# Altium schematic sheet PWR.SchDoc (part 2 of 3)
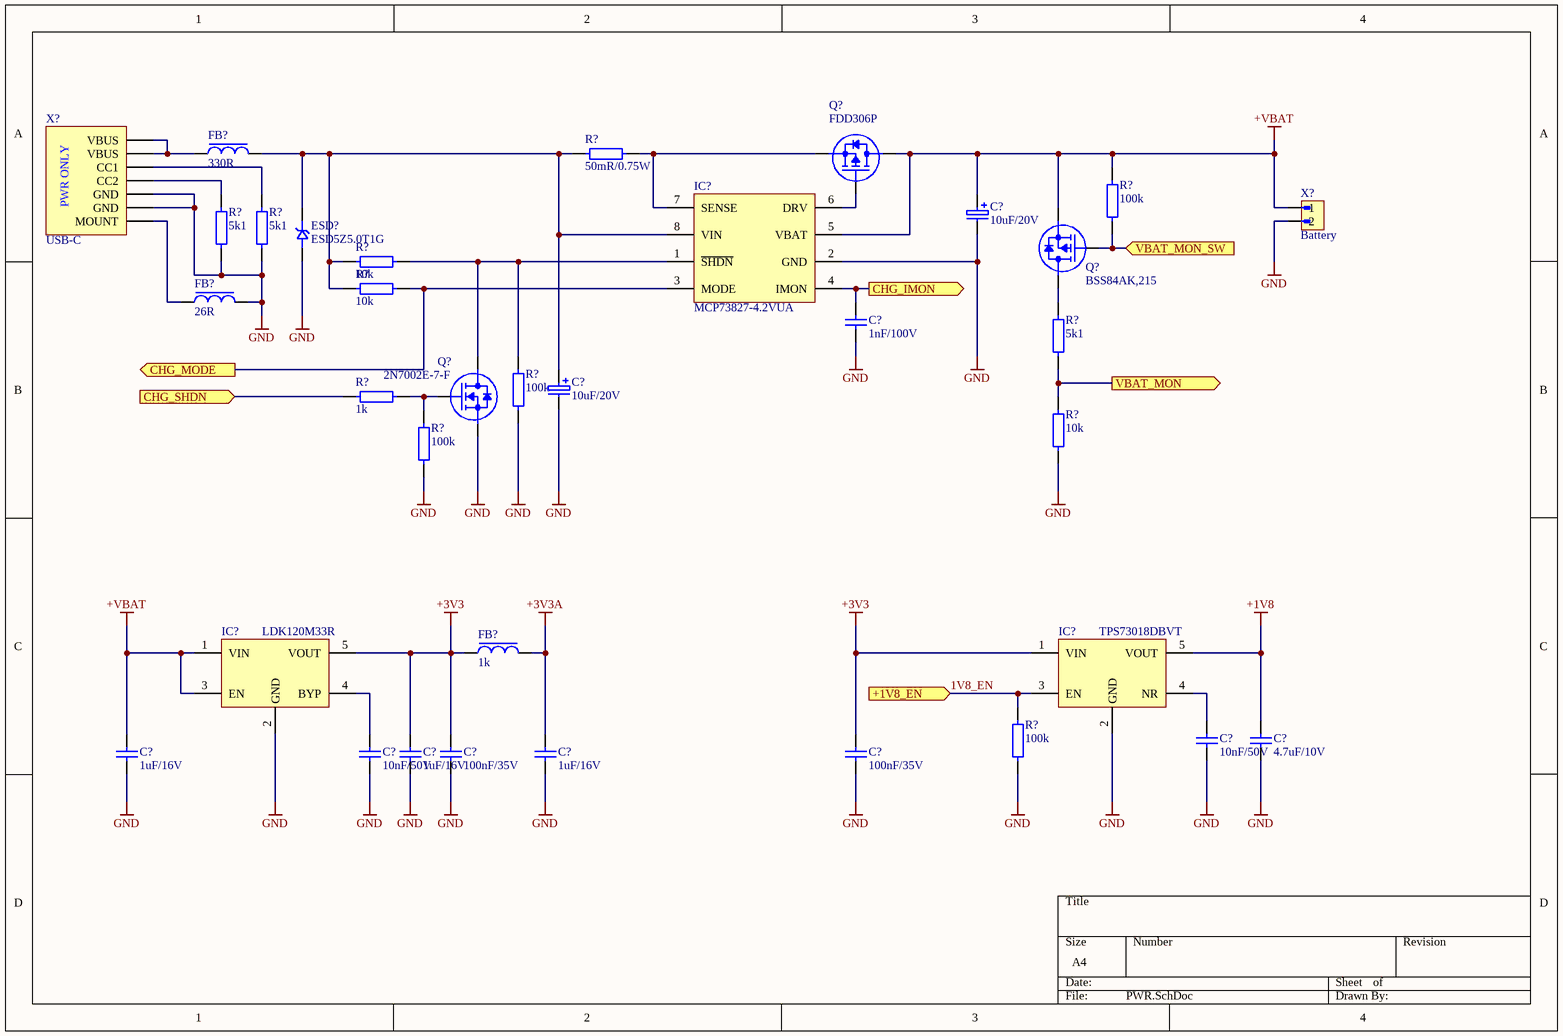
[diagram p1: PWR.SchDoc]
## Library data of the parts
C?#1 C?#3 = TCJB106M020R0150E: Tantalum Capacitors - Polymer 20V 10uF 20%1210 ESR=150ohm Blk Resin; Manufacturer: Kyocera AVX; Manufacturer Part Number: TCJB106M020R0150E; RoHS: Yes; Stock 1: 1215; Pricing 1: 1=0,90000, 10=0,68600, 50=0,56960, 100=0,49050, 500=0,37976, 1000=0,32702 (USD); Supplier 1: DigiKey; Supplier 2: Digi-Key; Supplier 3: Digi-Key; Supplier 4: Mouser; Supplier Part Number 1: 478-TCJB106M020R0150ECT-ND; Supplier Part Number 2: 478-TCJB106M020R0150ECT-ND; Supplier Part Number 3: 478-TCJB106M020R0150EDKR-ND; Supplier Part Number 4: 581-TCJB106M020R150E
C?#2 = 06031C102KAT2A: Cap MLCC SMD 0603 100V X7R 1000pF 10% Commercial Ti/Sn Plated 7"T/R; Manufacturer: Kyocera AVX; Dielectric Material: Ceramic; Capacitance: 1nF; Insulation Resistance: 100GR; Dissipation Factor: 2.5%; Supplier 1: Farnell; Supplier Part Number 1: 1833874; Manufacturer Part Number: 06031C102KAT2A; RoHS: Yes; Category: Ceramic Capacitors; Stock 1: 21717; Pricing 1: 10=0,05170, 100=0,04240, 500=0,02740, 1000=0,02080, 2000=0,01750, 4000=0,01420, 20000=0,01240 (GBP); Mount: Surface Mount,PCB; Case/Package: 0603; Number of Pins: 2; Case Code (Imperial): 0603; Case Code (Metric): 1608; Contact Plating: Tin,Matte; Min Operating Temperature: -55°C; Max Operating Temperature: 125°C; Tolerance: 10%; Dielectric: X7R; Packaging: Tape and Reel; Voltage Rating (DC): 100V; Voltage Rating: 100V; Package Quantity: 1; Termination: SMD/SMT; Voltage: 100V; Length: 1.6mm; Width: 0.81mm; Height: 0.9mm; Depth: 0.81mm; Thickness: 0.035inch; Radiation Hardening: No; REACH SVHC: No SVHC; Lead Free: Lead Free; ComponentLink1URL: https://datasheet.ciiva.com/2987/cx7r-2987733.pdf?src-supplier=Avnet; ComponentLink1Description: https://datasheet.ciiva.com/2987/cx7r-2987733.pdf?src-supplier=Avnet; ComponentLink2URL: https://datasheet.ciiva.com/7855/84526-7855189.pdf?src-supplier=Element14; ComponentLink2Description: https://datasheet.ciiva.com/7855/84526-7855189.pdf?src-supplier=Element14; ComponentLink3URL: https://datasheet.ciiva.com/11499/cx7r-11499669.pdf?src-supplier=Avnet; ComponentLink3Description: https://datasheet.ciiva.com/11499/cx7r-11499669.pdf?src-supplier=Avnet; ComponentLink4URL: https://datasheet.ciiva.com/1124/1679506-1124198.pdf?src-supplier=Element14; ComponentLink4Description: https://datasheet.ciiva.com/1124/1679506-1124198.pdf?src-supplier=Element14; ComponentLink5URL: https://datasheet.ciiva.com/16289/cx7r-16289400.pdf?src-supplier=Future+Electronics; ComponentLink5Description: https://datasheet.ciiva.com/16289/cx7r-16289400.pdf?src-supplier=Future+Electronics; ComponentLink6URL: https://datasheet.ciiva.com/5422/cx7r-218113-5422905.pdf?src-supplier=Mouser; ComponentLink6Description: https://datasheet.ciiva.com/5422/cx7r-218113-5422905.pdf?src-supplier=Mouser; ComponentLink7URL: https://datasheet.ciiva.com/7855/1679506-7855033.pdf?src-supplier=Element14; ComponentLink7Description: https://datasheet.ciiva.com/7855/1679506-7855033.pdf?src-supplier=Element14; ComponentLink8URL: https://datasheet.ciiva.com/150/cx7r-150395.pdf?src-supplier=Digi-Key; ComponentLink8Description: https://datasheet.ciiva.com/150/cx7r-150395.pdf?src-supplier=Digi-Key; ComponentLink9URL: https://datasheet.ciiva.com/22693/1679506-22693579.pdf?src-supplier=Element14; ComponentLink9Description: https://datasheet.ciiva.com/22693/1679506-22693579.pdf?src-supplier=Element14; ComponentLink10URL: https://datasheet.ciiva.com/150/cx7r-150396.pdf?src-supplier=Digi-Key; ComponentLink10Description: https://datasheet.ciiva.com/150/cx7r-150396.pdf?src-supplier=Digi-Key; ComponentLink11URL: https://datasheet.ciiva.com/14600/70001075-14600988.pdf?src-supplier=Allied+Electronics; ComponentLink11Description: https://datasheet.ciiva.com/14600/70001075-14600988.pdf?src-supplier=Allied+Electronics; ComponentLink12URL: https://datasheet.ciiva.com/150/cx7r-150397.pdf?src-supplier=Digi-Key; ComponentLink12Description: https://datasheet.ciiva.com/150/cx7r-150397.pdf?src-supplier=Digi-Key; ComponentLink13URL: https://datasheet.ciiva.com/14594/70001075-14594623.pdf?src-supplier=Allied+Electronics; ComponentLink13Description: https://datasheet.ciiva.com/14594/70001075-14594623.pdf?src-supplier=Allied+Electronics; ComponentLink14URL: https://datasheet.ciiva.com/16484/cx7r-16484383.pdf?src-supplier=Avnet+Asia; ComponentLink14Description: https://datasheet.ciiva.com/16484/cx7r-16484383.pdf?src-supplier=Avnet+Asia
C?#4 = CL10A475KP8NNNC: Cap Ceramic 4.7uF 10V X5R 10% Pad SMD 0603 85C T/R; Manufacturer: Samsung; Manufacturer Part Number: CL10A475KP8NNNC; RoHS: Yes; Category: Ceramic Capacitors; Stock 1: 28417; Pricing 1: 10=0,03100, 100=0,02530, 500=0,01720, 1000=0,01310, 2000=0,01120, 4000=0,00920, 20000=0,00700 (GBP); Mount: Surface Mount; Case/Package: 0603; Case Code (Imperial): 0603; Contact Plating: Tin; Case Code (Metric): 1608; Min Operating Temperature: -55°C; Max Operating Temperature: 85°C; Tolerance: 10%; Capacitance: 4.7uF; Dielectric: X5R; Package Quantity: 1; Packaging: Tape and Reel; Voltage Rating: 10V; Length: 1.6mm; Width: 0.031inch; Height: 0.8mm; Thickness: 0.035inch; Depth: 0.8mm; Radiation Hardening: No; ComponentLink1URL: https://datasheet.ciiva.com/25797/cl10a475kp8nnnc-25797520.pdf?src-supplier=Digi-Key; ComponentLink1Description: https://datasheet.ciiva.com/25797/cl10a475kp8nnnc-25797520.pdf?src-supplier=Digi-Key; ComponentLink2URL: https://datasheet.ciiva.com/26838/getdatasheetpartid-358676-26838384.pdf?src-supplier=Verical; ComponentLink2Description: https://datasheet.ciiva.com/26838/getdatasheetpartid-358676-26838384.pdf?src-supplier=Verical; ComponentLink3URL: https://datasheet.ciiva.com/16318/cl05b104kq5nnnc-16318245.pdf?src-supplier=Future+Electronics; ComponentLink3Description: https://datasheet.ciiva.com/16318/cl05b104kq5nnnc-16318245.pdf?src-supplier=Future+Electronics; Supplier 1: Farnell; Supplier 2: Mouser; Supplier 3: LCSC; Supplier 4: TME; Supplier Part Number 1: 3013398; Supplier Part Number 2: 187-CL10A475KP8NNNC; Supplier Part Number 3: C1705; Supplier Part Number 4: CL10A475KP8NNNC
C?#5 C?#7 = MCU0603R103KCT: MULTICOMP - MCU0603R103KCT - SMD Multilayer Ceramic Capacitor, 10000 pF, 50 V, 0603 [1608 Metric], ± 10%, X7R, MCU Series - SMD Multilayer Ceramic Capacitor, 10000 pF, 50 V, 0603 [1608 Metric], ± 10%, X7R, MCU Series; Voltage Rating: 50V; Capacitance: 10nF; Supplier 1: Farnell; Supplier Part Number 1: 9406182; Manufacturer: Multicomp; Manufacturer Part Number: MCU0603R103KCT; RoHS: Yes; Category: Uncategorized; Stock 1: 18740; Pricing 1: 10=0,01640, 100=0,01320, 500=0,00990, 1000=0,00830, 2000=0,00700, 4000=0,00500, 20000=0,00300, 40000=0,00250 (GBP); Case/Package: 0603; Case Code (Metric): 1608; Case Code (Imperial): 0603; Min Operating Temperature: -55°C; Max Operating Temperature: 125°C; Tolerance: 10%; Packaging: Cut Tape; Voltage Rating (DC): 50V; Dielectric: X7R; REACH SVHC: No SVHC; ComponentLink1URL: https://datasheet.ciiva.com/36857/1859359-36857356.pdf?src-supplier=Element14; ComponentLink1Description: https://datasheet.ciiva.com/36857/1859359-36857356.pdf?src-supplier=Element14; ComponentLink2URL: https://datasheet.ciiva.com/36857/1859359-36857567.pdf?src-supplier=Element14; ComponentLink2Description: https://datasheet.ciiva.com/36857/1859359-36857567.pdf?src-supplier=Element14
C?#6 C?#8 C?#10 = CL10A105KO8NNNC: SAMSUNG ELECTRO-MECHANICS - CL10A105KO8NNNC - CAP, 1UF, 16V, MLCC, 0603; Material: Ceramic; Tolerance: 10%; Dielectric: X5R; Supplier 1: Farnell; Supplier Part Number 1: 3013384; Manufacturer: Samsung; Manufacturer Part Number: CL10A105KO8NNNC; RoHS: Yes; Category: Ceramic Capacitors; Stock 1: 9460; Pricing 1: 10=0,02280, 100=0,01860, 500=0,01290, 1000=0,00990, 2000=0,00880, 4000=0,00770, 20000=0,00540 (GBP); Mount: Surface Mount; Case/Package: 0603; Case Code (Metric): 1608; Case Code (Imperial): 0603; Contact Plating: Tin; Min Operating Temperature: -55°C; Max Operating Temperature: 85°C; Capacitance: 1uF; Package Quantity: 1; Packaging: Tape and Reel; Voltage Rating: 16V; Voltage Rating (DC): 16V; Voltage: 16V; Length: 1.6mm; Width: 0.031inch; Height: 0.8mm; Thickness: 0.035inch; Depth: 0.8mm; Radiation Hardening: No; Lead Free: Lead Free; ComponentLink1URL: https://datasheet.ciiva.com/16199/cl10a105ko8nnnc-16199033.pdf?src-supplier=Future+Electronics; ComponentLink1Description: https://datasheet.ciiva.com/16199/cl10a105ko8nnnc-16199033.pdf?src-supplier=Future+Electronics; ComponentLink2URL: https://datasheet.ciiva.com/15195/getdatasheetpartid-359688-15195706.pdf?src-supplier=Verical; ComponentLink2Description: https://datasheet.ciiva.com/15195/getdatasheetpartid-359688-15195706.pdf?src-supplier=Verical; ComponentLink3URL: https://datasheet.ciiva.com/29198/458190-da-01-en-vs-kondensator-0603-29198480.pdf?src-supplier=Conrad; ComponentLink3Description: https://datasheet.ciiva.com/29198/458190-da-01-en-vs-kondensator-0603-29198480.pdf?src-supplier=Conrad; Supplier 2: Mouser; Supplier Part Number 2: 187-CL10A105KO8NNNC; Stock 2: 346877; Supplier 3: Digi-Key; Supplier Part Number 3: 1276-1034-6-ND; Stock 3: 1912529; Pricing 3: 1=0,10000, 10=0,03500, 50=0,01920, 100=0,01570, 500=0,01124, 1000=0,00883 (USD)
C?#9 C?#11 = 06035G104ZAT2A: CERAMIC CAPACITOR, 0.1UF, 50V, Y5V, +80,-20%, 0603, FULL REEL; Product Range:-; Capacitance:0.1 F; Capacitance Tolerance:+80%, -20%; Dielectric Characteristic:Y5V; Voltage Rating:50V; Ceramic Capacitor Case:0603 [1608 Metric] ;RoHS Compliant: Yes; Manufacturer: Kyocera AVX; Capacitance: 100nF; Tolerance: 80%; Supplier 1: Farnell; Supplier Part Number 1: 2332660; Manufacturer Part Number: 06035G104ZAT2A; RoHS: Yes; Category: Ceramic Capacitors; Stock 1: 29140; Pricing 1: 10=0,03250, 100=0,02120, 500=0,01780, 1000=0,01420, 2000=0,01220 (GBP); Mount: Surface Mount,PCB; Case/Package: 0603; Number of Pins: 2; Case Code (Metric): 1608; Case Code (Imperial): 0603; Contact Plating: Tin,Matte; Dielectric Material: Ceramic; Min Operating Temperature: -30°C; Max Operating Temperature: 85°C; Dielectric: Y5V; Packaging: Tape and Reel; Voltage Rating (DC): 50V; Voltage Rating: 50V; Package Quantity: 1; Termination: SMD/SMT; Voltage: 50V; Series: -; Construction: Flat; Length: 1.6mm; Width: 0.032inch; Height: 0.63mm; Depth: 0.81mm; Thickness: 0.035inch; Radiation Hardening: No; REACH SVHC: No SVHC; Lead Free: Lead Free; RoHS Compliant: Yes; ComponentLink1URL: https://datasheet.ciiva.com/2987/cy5v-2987860.pdf?src-supplier=Avnet; ComponentLink1Description: https://datasheet.ciiva.com/2987/cy5v-2987860.pdf?src-supplier=Avnet; ComponentLink2URL: https://datasheet.ciiva.com/16359/cy5v-16359895.pdf?src-supplier=Future+Electronics; ComponentLink2Description: https://datasheet.ciiva.com/16359/cy5v-16359895.pdf?src-supplier=Future+Electronics; ComponentLink3URL: https://datasheet.ciiva.com/28613/578190-28613048.pdf?src-supplier=Element14; ComponentLink3Description: https://datasheet.ciiva.com/28613/578190-28613048.pdf?src-supplier=Element14; ComponentLink4URL: https://datasheet.ciiva.com/151/cy5v-151545.pdf?src-supplier=Digi-Key; ComponentLink4Description: https://datasheet.ciiva.com/151/cy5v-151545.pdf?src-supplier=Digi-Key; ComponentLink5URL: https://datasheet.ciiva.com/151/cy5v-151546.pdf?src-supplier=Digi-Key; ComponentLink5Description: https://datasheet.ciiva.com/151/cy5v-151546.pdf?src-supplier=Digi-Key; ComponentLink6URL: https://datasheet.ciiva.com/151/cy5v-151547.pdf?src-supplier=Digi-Key; ComponentLink6Description: https://datasheet.ciiva.com/151/cy5v-151547.pdf?src-supplier=Digi-Key; ComponentLink7URL: https://datasheet.ciiva.com/11499/cy5v-11499710.pdf?src-supplier=Avnet; ComponentLink7Description: https://datasheet.ciiva.com/11499/cy5v-11499710.pdf?src-supplier=Avnet; Supplier 2: Mouser; Supplier Part Number 2: 581-06035G104Z; Stock 2: 97036; Pricing 2: 1=0,09000, 10=0,03300, 50=0,03300, 100=0,02700, 1000=0,01600, 10000=0,01000 (USD); Supplier 3: Digi-Key; Supplier Part Number 3: 478-3724-6-ND; Stock 3: 629269; Pricing 3: 1=0,10000, 10=0,05900, 50=0,03220, 100=0,02640, 500=0,01882, 1000=0,01479 (USD)
ESD? = ESD5Z5.0T1G: ESD Suppressors / TVS Diodes 5V ESD Protection Unidirectional, SOD-523; Manufacturer: ON Semiconductor; Clamping Voltage: 18.6V; Peak Pulse Power: 174W; Min Breakdown Voltage: 6.2V; Peak Pulse Current: 9.4A; Element Configuration: Single; Number of Channels: 1; Power Line Protection: No; Capacitance: 80pF; Leakage Current: 50nA; Test Current: 1mA; Diode Type: ZENER; ESD Protection: Yes; Max Power Dissipation: 240W; Clamping Voltage-Max: 11.6V; Supplier 1: Farnell; Manufacturer Part Number: ESD5Z5.0T1G; RoHS: Yes; Category: ESD and Circuit Protection ICs; Pricing 1: 5=0,28400, 10=0,22500, 100=0,11300, 500=0,07020 (GBP); Case/Package: SOD-523-2; Number of Pins: 2; Contact Plating: Tin,Matte; Min Operating Temperature: -55°C; Max Operating Temperature: 150°C; Packaging: Tape and Reel; Direction: Unidirectional; Reverse Standoff Voltage: 5V; Operating Supply Voltage: 5V; Package Quantity: 1; Max Surge Current: 9.4A; Number of Unidirectional Channels: 1; Breakdown Voltage: 6.2V; Polarity: Unidirectional; Termination: SMD/SMT; Working Voltage: 5V; Resistor Type: Zener; Series: Automotive, AEC-Q101; Max Reverse Leakage Current: 50nA; Number of Elements: 1; Reverse Breakdown Voltage: 6.2V; Max Breakdown Voltage: 6.2V; Number of Lines: 1; Length: 1.2mm; Width: 0.9mm; Height: 0.7mm; Depth: 0.8mm; Radiation Hardening: No; RoHS Compliant: Yes; Lead Free: Lead Free; Halogen Free: Halogen Free; REACH SVHC: No SVHC; ComponentLink1URL: https://datasheet.ciiva.com/22637/esd5z2-5t1-d-22637184.pdf?src-supplier=Element14; ComponentLink1Description: https://datasheet.ciiva.com/22637/esd5z2-5t1-d-22637184.pdf?src-supplier=Element14; ComponentLink2URL: https://datasheet.ciiva.com/30479/0900766b8125092b-30479039.pdf?src-supplier=RSComponents; ComponentLink2Description: https://datasheet.ciiva.com/30479/0900766b8125092b-30479039.pdf?src-supplier=RSComponents; ComponentLink3URL: https://datasheet.ciiva.com/15143/getdatasheetpartid-147990-15143766.pdf?src-supplier=Verical; ComponentLink3Description: https://datasheet.ciiva.com/15143/getdatasheetpartid-147990-15143766.pdf?src-supplier=Verical; ComponentLink4URL: https://datasheet.ciiva.com/27748/1311839-27748800.pdf?src-supplier=Jameco; ComponentLink4Description: https://datasheet.ciiva.com/27748/1311839-27748800.pdf?src-supplier=Jameco; ComponentLink5URL: https://datasheet.ciiva.com/8084/esd5z2-5t1-d-8084057.pdf?src-supplier=Avnet; ComponentLink5Description: https://datasheet.ciiva.com/8084/esd5z2-5t1-d-8084057.pdf?src-supplier=Avnet; ComponentLink6URL: https://datasheet.ciiva.com/16385/esd5z2-5t1-d-16385093.pdf?src-supplier=Future+Electronics; ComponentLink6Description: https://datasheet.ciiva.com/16385/esd5z2-5t1-d-16385093.pdf?src-supplier=Future+Electronics; ComponentLink7URL: https://datasheet.ciiva.com/25958/esd5z2-5t1-d-25958603.pdf?src-supplier=Avnet+Europe; ComponentLink7Description: https://datasheet.ciiva.com/25958/esd5z2-5t1-d-25958603.pdf?src-supplier=Avnet+Europe; ComponentLink8URL: https://datasheet.ciiva.com/339/esd5z2-5t1-d-339749.pdf?src-supplier=Digi-Key; ComponentLink8Description: https://datasheet.ciiva.com/339/esd5z2-5t1-d-339749.pdf?src-supplier=Digi-Key; ComponentLink9URL: https://datasheet.ciiva.com/339/esd5z2-5t1-d-339750.pdf?src-supplier=Digi-Key; ComponentLink9Description: https://datasheet.ciiva.com/339/esd5z2-5t1-d-339750.pdf?src-supplier=Digi-Key; ComponentLink10URL: https://datasheet.ciiva.com/339/esd5z2-5t1-d-339748.pdf?src-supplier=Digi-Key; ComponentLink10Description: https://datasheet.ciiva.com/339/esd5z2-5t1-d-339748.pdf?src-supplier=Digi-Key; ComponentLink11URL: https://datasheet.ciiva.com/22637/1878252-22637182.pdf?src-supplier=Element14; ComponentLink11Description: https://datasheet.ciiva.com/22637/1878252-22637182.pdf?src-supplier=Element14; Supplier 2: Mouser; Supplier 3: Digi-Key; Supplier 4: TME; Supplier 5: LCSC; Supplier Part Number 1: 2317510; Supplier Part Number 2: 863-ESD5Z5.0T1G; Supplier Part Number 3: ESD5Z5.0T1GOSCT-ND; Supplier Part Number 4: ESD5Z5.0T1G; Supplier Part Number 5: C82044
FB?#1 = BLM18KG331SN1D: Ferrite Beads 0603 330ohms 1.7A; Manufacturer: Murata; Material: Ferrite,Steel; Tolerance: 25%; Number of Lines: 1; DC Resistance (DCR): 80mR; Test Frequency: 100MHz; Supplier 1: Digi-Key; Manufacturer Part Number: BLM18KG331SN1D; RoHS: Yes; Category: Ferrite Beads and Chips; Stock 1: 59; Pricing 1: 1=0,10000, 10=0,08700, 25=0,07920, 50=0,07120, 100=0,05230, 250=0,03800, 500=0,03484, 1000=0,03010 (USD); Case/Package: 0603; Number of Pins: 2; Core Material: Ferrite; Case Code (Metric): 1608; Case Code (Imperial): 0603; Weight: 7.1E-05oz; Min Operating Temperature: -55°C; Max Operating Temperature: 125°C; Package Quantity: 1; Impedance: 330R; Packaging: Tape and Reel; Current Rating: 1.7A; Max Current Rating: 1.7A; Termination: SMD/SMT; Max DC Current: 1.7A; Number of Circuits: 1; Length: 1.6mm; Width: 0.8mm; Height: 0.8mm; Depth: 0.95mm; REACH SVHC: No SVHC; Lead Free: Lead Free; ComponentLink1URL: https://datasheet.ciiva.com/1012/l0110e-1012338.pdf?src-supplier=Digi-Key; ComponentLink1Description: https://datasheet.ciiva.com/1012/l0110e-1012338.pdf?src-supplier=Digi-Key; ComponentLink2URL: https://datasheet.ciiva.com/1012/l0110e-1012339.pdf?src-supplier=Digi-Key; ComponentLink2Description: https://datasheet.ciiva.com/1012/l0110e-1012339.pdf?src-supplier=Digi-Key; ComponentLink3URL: https://datasheet.ciiva.com/1012/l0110e-1012340.pdf?src-supplier=Digi-Key; ComponentLink3Description: https://datasheet.ciiva.com/1012/l0110e-1012340.pdf?src-supplier=Digi-Key; ComponentLink4URL: https://datasheet.ciiva.com/22715/486545-22715704.pdf?src-supplier=Element14; ComponentLink4Description: https://datasheet.ciiva.com/22715/486545-22715704.pdf?src-supplier=Element14; ComponentLink5URL: https://datasheet.ciiva.com/16419/l0110s0100blm18k-16419178.pdf?src-supplier=Future+Electronics; ComponentLink5Description: https://datasheet.ciiva.com/16419/l0110s0100blm18k-16419178.pdf?src-supplier=Future+Electronics; ComponentLink6URL: https://datasheet.ciiva.com/41449/001171712-da-01-en-chip-drossel0603-330r-xxxma-1-6x0-8mm-41449388.pdf?src-supplier=Conrad; ComponentLink6Description: https://datasheet.ciiva.com/41449/001171712-da-01-en-chip-drossel0603-330r-xxxma-1-6x0-8mm-41449388.pdf?src-supplier=Conrad; Supplier 2: Mouser; Supplier 3: TME; Supplier 4: Farnell; Supplier 5: LCSC; Supplier Part Number 1: 490-5256-1-ND; Supplier Part Number 2: 81-BLM18KG331SN1D; Supplier Part Number 3: BLM18KG331SN1D; Supplier Part Number 4: 1781092; Supplier Part Number 5: C85832
FB?#2 = BLM18KG260TN1D: Ferrite Beads Multi-Layer 26Ohm 25% 100MHz 6A 7mOhm DCR 0603 T/R; Manufacturer: Murata; Material: Ferrite,Steel; DC Resistance (DCR): 7mR; Number of Lines: 1; Supplier 1: Farnell; Manufacturer Part Number: BLM18KG260TN1D; RoHS: Yes; Category: Ferrite Beads and Chips; Stock 1: 251; Pricing 1: 10=0,04380, 100=0,03170, 500=0,01970, 1000=0,01880, 2000=0,01780, 4000=0,01460, 20000=0,01160 (GBP); Case/Package: 0603; Number of Pins: 2; Core Material: Ferrite; Case Code (Metric): 1608; Case Code (Imperial): 0603; Min Operating Temperature: -55°C; Max Operating Temperature: 125°C; Impedance: 26R; Package Quantity: 1; Tolerance: 25%; Packaging: Tape and Reel; Current Rating: 6A; Max Current Rating: 6A; Max DC Current: 6A; Termination: SMD/SMT; Test Frequency: 100MHz; Number of Circuits: 1; Series: BLM18K; DC Resistance-Max: 7mR; Inductor Type: FERRITE BEAD; Length: 1.6mm; Width: 0.8mm; Height: 0.8mm; Depth: 0.95mm; REACH SVHC: No SVHC; Lead Free: Lead Free; RoHS Compliant: Yes; ComponentLink1URL: https://datasheet.ciiva.com/1561/486545-1561360.pdf?src-supplier=Newark; ComponentLink1Description: https://datasheet.ciiva.com/1561/486545-1561360.pdf?src-supplier=Newark; ComponentLink2URL: https://datasheet.ciiva.com/11795/0900766b81076276-11795745.pdf?src-supplier=RSComponents; ComponentLink2Description: https://datasheet.ciiva.com/11795/0900766b81076276-11795745.pdf?src-supplier=RSComponents; ComponentLink3URL: https://datasheet.ciiva.com/3082/l0110s0100blm18k-3082724.pdf?src-supplier=Avnet; ComponentLink3Description: https://datasheet.ciiva.com/3082/l0110s0100blm18k-3082724.pdf?src-supplier=Avnet; ComponentLink4URL: https://datasheet.ciiva.com/1012/l0110e-1012293.pdf?src-supplier=Digi-Key; ComponentLink4Description: https://datasheet.ciiva.com/1012/l0110e-1012293.pdf?src-supplier=Digi-Key; ComponentLink5URL: https://datasheet.ciiva.com/1012/l0110e-1012294.pdf?src-supplier=Digi-Key; ComponentLink5Description: https://datasheet.ciiva.com/1012/l0110e-1012294.pdf?src-supplier=Digi-Key; ComponentLink6URL: https://datasheet.ciiva.com/1012/l0110e-1012295.pdf?src-supplier=Digi-Key; ComponentLink6Description: https://datasheet.ciiva.com/1012/l0110e-1012295.pdf?src-supplier=Digi-Key; ComponentLink7URL: https://datasheet.ciiva.com/22715/486545-22715703.pdf?src-supplier=Element14; ComponentLink7Description: https://datasheet.ciiva.com/22715/486545-22715703.pdf?src-supplier=Element14; ComponentLink8URL: https://datasheet.ciiva.com/16419/l0110s0100blm18k-16419176.pdf?src-supplier=Future+Electronics; ComponentLink8Description: https://datasheet.ciiva.com/16419/l0110s0100blm18k-16419176.pdf?src-supplier=Future+Electronics; Supplier 2: Digi-Key; Supplier 3: Mouser; Supplier 4: TME; Supplier 5: LCSC; Supplier Part Number 1: 1781087; Supplier Part Number 2: 490-5252-1-ND; Supplier Part Number 3: 81-BLM18KG260TN1D; Supplier Part Number 4: BLM18KG260TN1D; Supplier Part Number 5: C88981
FB?#3 = BLM18KG102SZ1D: Ferrite Beads Multi-Layer Power 1KOhm 25% 100MHz 1A 200mOhm DCR 0603 Automotive T/R; Manufacturer: Murata; Number of Lines: 1; DC Resistance (DCR): 200mR; Supplier 1: Digi-Key; Manufacturer Part Number: BLM18KG102SZ1D; RoHS: Yes; Category: Ferrite Beads and Chips; Stock 1: 28125; Pricing 1: 1=0,10000, 10=0,07300, 25=0,06520, 50=0,05540, 100=0,04880, 250=0,04476, 500=0,04070, 1000=0,03419 (USD); Mount: Surface Mount; Case/Package: 0603; Case Code (Imperial): 0603; Case Code (Metric): 1608; Min Operating Temperature: -55°C; Max Operating Temperature: 125°C; Packaging: Cut Tape; Max Current Rating: 1A; Ratings: AEC-Q200; RoHS Compliant: Yes; ComponentLink1URL: https://www.murata.com/~/media/webrenewal/support/library/catalog/products/emc/emifil/c51e.ashx?la=en-us&src-supplier=Digi-Key; ComponentLink1Description: https://www.murata.com/~/media/webrenewal/support/library/catalog/products/emc/emifil/c51e.ashx?la=en-us&src-supplier=Digi-Key; ComponentLink2URL: https://www.murata.com/en-us/products/productdata/8796750610462/QNFA9122.pdf?src-supplier=Digi-Key; ComponentLink2Description: https://www.murata.com/en-us/products/productdata/8796750610462/QNFA9122.pdf?src-supplier=Digi-Key; Supplier 2: Mouser; Supplier 3: Farnell; Supplier Part Number 1: 490-17350-1-ND; Supplier Part Number 2: 81-BLM18KG102SZ1D; Supplier Part Number 3: 3471117
IC?#1 = MCP73827-4.2VUA: MICROCHIP   MCP73827-4.2VUA   BATT CHARGER, LI-ION, 4.2V, 8-MSOP; Min Supply Voltage: 4.5V; Max Supply Voltage: 5.5V; Operating Supply Current: 560mA; Number of Cells: 1; Max Output Current: 75mA; Max Output Voltage: 4.141V; Min Output Voltage: 4.059V; Max Charge Current: 500mA; Battery Type: LITHIUM-ION; Supplier 1: Digi-Key; Manufacturer: Microchip; Manufacturer Part Number: MCP73827-4.2VUA; RoHS: Yes; Category: Battery Management; Stock 1: 51; Pricing 1: 1=1,13000, 25=1,03520 (USD); Mount: Surface Mount; Case/Package: MSOP; Number of Pins: 8; Min Operating Temperature: -20°C; Max Operating Temperature: 85°C; Output Voltage: 4.2V; Packaging: Rail/Tube; Package Quantity: 100; Series: -; Nominal Supply Current: 560mA; Length: 3mm; Width: 4.9mm; Height: 1.1mm; Radiation Hardening: No; Lead Free: Lead Free; RoHS Compliant: Yes; REACH SVHC: No SVHC; ComponentLink1URL: https://datasheet.ciiva.com/1137/809262-1137801.pdf?src-supplier=Element14; ComponentLink1Description: https://datasheet.ciiva.com/1137/809262-1137801.pdf?src-supplier=Element14; ComponentLink2URL: https://datasheet.ciiva.com/1933/filehandler-aspxddocname-en026002-1933092.pdf?src-supplier=Digi-Key; ComponentLink2Description: https://datasheet.ciiva.com/1933/filehandler-aspxddocname-en026002-1933092.pdf?src-supplier=Digi-Key; ComponentLink3URL: https://datasheet.ciiva.com/3215/21704b-3215285.pdf?src-supplier=Avnet; ComponentLink3Description: https://datasheet.ciiva.com/3215/21704b-3215285.pdf?src-supplier=Avnet; ComponentLink4URL: https://datasheet.ciiva.com/4873/21704a-74947-4873749.pdf?src-supplier=Mouser; ComponentLink4Description: https://datasheet.ciiva.com/4873/21704a-74947-4873749.pdf?src-supplier=Mouser; ComponentLink5URL: https://datasheet.ciiva.com/48910/70389230-48910519.pdf?src-supplier=Allied+Electronics; ComponentLink5Description: https://datasheet.ciiva.com/48910/70389230-48910519.pdf?src-supplier=Allied+Electronics; Supplier 2: Mouser; Supplier 3: Farnell; Supplier Part Number 1: MCP73827-4.2VUA-ND; Supplier Part Number 2: 579-MCP73827-4.2VUA; Supplier Part Number 3: 1852161
IC?#2 = LDK120M33R: IC REG LINEAR 3.3V 200MA SOT23-5; Manufacturer: STMicroelectronics; Dropout Voltage: 300mV; Max Input Voltage: 5.5V; Min Input Voltage: 1.9V; Number of Outputs: 1; Nominal Supply Current: 50uA; Polarity: Positive; Quiescent Current: 60uA; Output Voltage Accuracy: 2%; Output Type: Fixed; Supplier 1: Digi-Key; Manufacturer Part Number: LDK120M33R; RoHS: Yes; Category: Voltage Regulators - Linear; Stock 1: 10003; Pricing 1: 1=0,75000, 10=0,66100, 25=0,62120, 100=0,50690, 250=0,47080, 500=0,40068, 1000=0,33075 (USD); Mount: Surface Mount; Case/Package: SOT-23-5; Number of Pins: 5; Min Operating Temperature: -40°C; Max Operating Temperature: 125°C; Max Output Current: 200mA; Package Quantity: 1; Packaging: Tape and Reel; Output Voltage: 3.3V; Output Current: 200mA; Number of Regulators: 1; Accuracy: 2%; Tolerance: 2%; Series: -; Supply Current: 50uA; Lead Free: Lead Free; RoHS Compliant: Yes; ComponentLink1URL: https://datasheet.ciiva.com/41440/001184882-da-01-en-ic-reg-ldo-3-3v-ldk120m33r-sot-23-5-stm-41440022.pdf?src-supplier=Conrad; ComponentLink1Description: https://datasheet.ciiva.com/41440/001184882-da-01-en-ic-reg-ldo-3-3v-ldk120m33r-sot-23-5-stm-41440022.pdf?src-supplier=Conrad; ComponentLink2URL: https://datasheet.ciiva.com/6591/dm00070790-6591189.pdf?src-supplier=Digi-Key; ComponentLink2Description: https://datasheet.ciiva.com/6591/dm00070790-6591189.pdf?src-supplier=Digi-Key; ComponentLink3URL: https://datasheet.ciiva.com/6591/dm00070790-6591190.pdf?src-supplier=Digi-Key; ComponentLink3Description: https://datasheet.ciiva.com/6591/dm00070790-6591190.pdf?src-supplier=Digi-Key; ComponentLink4URL: https://datasheet.ciiva.com/8228/dm00070790-8228653.pdf?src-supplier=Avnet; ComponentLink4Description: https://datasheet.ciiva.com/8228/dm00070790-8228653.pdf?src-supplier=Avnet; Supplier 2: Mouser; Supplier 3: TME; Supplier 4: LCSC; Supplier 5: Farnell; Supplier Part Number 1: 497-13500-1-ND; Supplier Part Number 2: 511-LDK120M33R; Supplier Part Number 3: LDK120M33R; Supplier Part Number 4: C2688675; Supplier Part Number 5: 2849787
IC?#3 = TPS73018DBVT: Fixed LDO Voltage Regulator, 2.7V to 5.5V, 120mV Dropout, 1.8Vout, 200mAout, SOT-23-5; Manufacturer: Texas Instruments; Output Voltage: 1.8V; Number of Outputs: 1; Output Current: 200mA; Max Power Dissipation: 560mW; Min Current Limit: 285mA; Polarity: Positive; Quiescent Current: 170uA; Accuracy: 2%; Supplier 1: Digi-Key; Manufacturer Part Number: TPS73018DBVT; RoHS: Yes; Category: Voltage Regulators - Linear; Stock 1: 5519; Pricing 1: 1=0,93000, 10=0,81900, 25=0,76880, 100=0,62750 (USD); Case/Package: SOT-23; Number of Pins: 5; Contact Plating: Tin,Matte; Min Operating Temperature: -40°C; Max Operating Temperature: 85°C; Packaging: Tape and Reel; Package Quantity: 1; Max Output Current: 200mA; Max Input Voltage: 5.5V; Min Input Voltage: 2.7V; Number of Regulators: 1; Output Type: Fixed; Power Rating: 560mW; Dropout Voltage: 120mV; Input Bias Current: 170uA; Power Dissipation: 560mW; Min Output Voltage: 1.8V; Output Voltage Accuracy: 2%; Max Output Voltage: 1.8V; Nominal Output Voltage: 1.8V; Min Supply Voltage: 2.7V; Termination: SMD/SMT; Length: 2.9mm; Width: 1.6mm; Height: 1.15mm; Radiation Hardening: No; Lead Free: Lead Free; RoHS Compliant: Yes; REACH SVHC: No SVHC; ComponentLink1URL: https://datasheet.ciiva.com/26904/tps73018dbvt-26904036.pdf?src-supplier=IIIC; ComponentLink1Description: https://datasheet.ciiva.com/26904/tps73018dbvt-26904036.pdf?src-supplier=IIIC; ComponentLink2URL: https://datasheet.ciiva.com/41462/001014994-da-01-en-ic-reg-ldo-1-8v-0-tps73018dbvt-sot-5-tid-41462839.pdf?src-supplier=Conrad; ComponentLink2Description: https://datasheet.ciiva.com/41462/001014994-da-01-en-ic-reg-ldo-1-8v-0-tps73018dbvt-sot-5-tid-41462839.pdf?src-supplier=Conrad; ComponentLink3URL: https://datasheet.ciiva.com/46390/1877105-46390197.pdf?src-supplier=Element14; ComponentLink3Description: https://datasheet.ciiva.com/46390/1877105-46390197.pdf?src-supplier=Element14; ComponentLink4URL: https://datasheet.ciiva.com/2052/tps730-2052232.pdf?src-supplier=Digi-Key; ComponentLink4Description: https://datasheet.ciiva.com/2052/tps730-2052232.pdf?src-supplier=Digi-Key; ComponentLink5URL: https://datasheet.ciiva.com/28684/1877105-28684534.pdf?src-supplier=Element14; ComponentLink5Description: https://datasheet.ciiva.com/28684/1877105-28684534.pdf?src-supplier=Element14; ComponentLink6URL: https://datasheet.ciiva.com/7993/1861024-7993016.pdf?src-supplier=Element14; ComponentLink6Description: https://datasheet.ciiva.com/7993/1861024-7993016.pdf?src-supplier=Element14; ComponentLink7URL: https://datasheet.ciiva.com/22700/1861024-22700040.pdf?src-supplier=Element14; ComponentLink7Description: https://datasheet.ciiva.com/22700/1861024-22700040.pdf?src-supplier=Element14; ComponentLink8URL: https://datasheet.ciiva.com/2052/tps730-2052233.pdf?src-supplier=Digi-Key; ComponentLink8Description: https://datasheet.ciiva.com/2052/tps730-2052233.pdf?src-supplier=Digi-Key; ComponentLink9URL: https://datasheet.ciiva.com/2052/tps730-2052234.pdf?src-supplier=Digi-Key; ComponentLink9Description: https://datasheet.ciiva.com/2052/tps730-2052234.pdf?src-supplier=Digi-Key; ComponentLink10URL: https://datasheet.ciiva.com/46385/1877105-46385674.pdf?src-supplier=Element14; ComponentLink10Description: https://datasheet.ciiva.com/46385/1877105-46385674.pdf?src-supplier=Element14; Supplier 2: Mouser; Supplier 3: TME; Supplier 4: Farnell; Supplier Part Number 1: 296-17577-1-ND; Supplier Part Number 2: 595-TPS73018DBVT; Supplier Part Number 3: TPS73018DBVT; Supplier Part Number 4: 3007850
Q?#1 = FDD306P: Trans MOSFET P-CH 12V 6.7A 3-Pin(2+Tab) TO-252AA T/R; Manufacturer: ON Semiconductor / Fairchild; Rise Time: 8ns; Rds On Max: 28mR; Input Capacitance: 1.29nF; Nominal Vgs: -500mV; Max Power Dissipation: 52W; Number of Elements: 1; Fall Time: 41ns; Turn-Off Delay Time: 34ns; Turn-On Delay Time: 16ns; Element Configuration: Single; Drain to Source Breakdown Voltage: -12V; Gate to Source Voltage (Vgs): 8V; Current Rating: -6.7A; On-State Resistance: 90MR; Polarity: P-CHANNEL; Supplier 1: Digi-Key; Manufacturer Part Number: FDD306P; RoHS: Yes; Category: MOSFETs; Stock 1: 163; Pricing 1: 1=0,93000, 10=0,83100, 100=0,64770, 500=0,53504, 1000=0,44800 (USD); Mount: Surface Mount; Case/Package: TO-252AA; Number of Pins: 3; Contact Plating: Tin,Matte; Weight: 0.26037g; Min Operating Temperature: -55°C; Max Operating Temperature: 175°C; Package Quantity: 1; Packaging: Tape and Reel; Drain to Source Voltage (Vdss): 12V; Continuous Drain Current (ID): 6.7A; Power Dissipation: 52W; Drain to Source Resistance: 28mR; Voltage Rating (DC): -12V; Series: PowerTrench®; Drain-source On Resistance-Max: 90MR; Dual Supply Voltage: -12V; Threshold Voltage: -500mV; Length: 6.73mm; Width: 6.22mm; Height: 2.39mm; Radiation Hardening: No; REACH SVHC: No SVHC; Lead Free: Lead Free; RoHS Compliant: Yes; ComponentLink1URL: https://datasheet.ciiva.com/6382/fdd306p-6382784.pdf?src-supplier=Digi-Key; ComponentLink1Description: https://datasheet.ciiva.com/6382/fdd306p-6382784.pdf?src-supplier=Digi-Key; ComponentLink2URL: https://datasheet.ciiva.com/6037/83415-6037185.pdf?src-supplier=Farnell; ComponentLink2Description: https://datasheet.ciiva.com/6037/83415-6037185.pdf?src-supplier=Farnell; ComponentLink3URL: https://datasheet.ciiva.com/4441/fdd306p-46305-4441610.pdf?src-supplier=Mouser; ComponentLink3Description: https://datasheet.ciiva.com/4441/fdd306p-46305-4441610.pdf?src-supplier=Mouser; ComponentLink4URL: https://datasheet.ciiva.com/25625/0900766b810c9606-25625803.pdf?src-supplier=RSComponents; ComponentLink4Description: https://datasheet.ciiva.com/25625/0900766b810c9606-25625803.pdf?src-supplier=RSComponents; ComponentLink5URL: https://datasheet.ciiva.com/6382/fdd306p-6382789.pdf?src-supplier=Digi-Key; ComponentLink5Description: https://datasheet.ciiva.com/6382/fdd306p-6382789.pdf?src-supplier=Digi-Key; ComponentLink6URL: https://datasheet.ciiva.com/26144/fdd306p-26144694.pdf?src-supplier=Avnet+Europe; ComponentLink6Description: https://datasheet.ciiva.com/26144/fdd306p-26144694.pdf?src-supplier=Avnet+Europe; ComponentLink7URL: https://datasheet.ciiva.com/7967/1815137-7967866.pdf?src-supplier=Element14; ComponentLink7Description: https://datasheet.ciiva.com/7967/1815137-7967866.pdf?src-supplier=Element14; ComponentLink8URL: https://datasheet.ciiva.com/17275/fdd306p-17275019.pdf?src-supplier=Future+Electronics; ComponentLink8Description: https://datasheet.ciiva.com/17275/fdd306p-17275019.pdf?src-supplier=Future+Electronics; Supplier 2: Mouser; Supplier 3: Farnell; Supplier 4: TME; Supplier Part Number 1: FDD306PCT-ND; Supplier Part Number 2: 512-FDD306P; Supplier Part Number 3: 9958827; Supplier Part Number 4: FDD306P
Q?#2 = BSS84AK,215: Small Signal Field-Effect Transistor, 0.18A I(D), 50V, 1-Element, P-Channel, Silicon, Metal-oxide Semiconductor FET, TO-236AB; Manufacturer: Nexperia; Package Body Material: Plastic; Drain Current-Max (ID): 180mA; Drain-source On Resistance-Max: 8.5R; Number of Elements: 1; Operating Mode: ENHANCEMENT MODE; Time @ Peak Reflow Temperature-Max (s): 30s; Transistor Application: SWITCHING; Reference Standard: AEC-Q101; Supplier 1: Farnell; Supplier Part Number 1: 1972673; Manufacturer Part Number: BSS84AK,215; RoHS: Yes; Category: MOSFETs; Stock 1: 14518; Pricing 1: 5=0,19500, 10=0,13100, 100=0,05230, 500=0,03910, 1000=0,02580, 5000=0,02360 (GBP); Number of Pins: 3; Package Shape: Rectangular; Terminal Finish: Tin; Transistor Element Material: SILICON; JESD-609 Code: e3; Polarity/Channel Type: P-CHANNEL; DS Breakdown Voltage-Min: 50V; FET Technology: METAL-OXIDE SEMICONDUCTOR; JESD-30 Code: R-PDSO-G3; Moisture Sensitivity Level: 1; Package Style: SMALL OUTLINEMeter; Peak Reflow Temperature (Cel): 260°C; Surface Mount: Yes; Terminal Form: Gull Wing; Terminal Position: DUAL; JEDEC-95 Code: TO-236AB; REACH SVHC: Yes; RoHS Compliant: Yes; ComponentLink1URL: https://datasheet.ciiva.com:443/pdfs/VipMasterIC/IC/NEXP/NEXP-S-A0002881811/NEXP-S-A0002881395-1.pdf?src-supplier=IHS+Markit; ComponentLink1Description: https://datasheet.ciiva.com:443/pdfs/VipMasterIC/IC/NEXP/NEXP-S-A0002881811/NEXP-S-A0002881395-1.pdf?src-supplier=IHS+Markit; ComponentLink2URL: http://www.farnell.com/datasheets/1443354.pdf?src-supplier=Farnell; ComponentLink2Description: http://www.farnell.com/datasheets/1443354.pdf?src-supplier=Farnell; ComponentLink3URL: https://assets.nexperia.com/documents/data-sheet/BSS84AK.pdf?src-supplier=Digi-Key; ComponentLink3Description: https://assets.nexperia.com/documents/data-sheet/BSS84AK.pdf?src-supplier=Digi-Key; Supplier 2: Mouser; Supplier Part Number 2: 771-BSS84AK215; Stock 2: 5227; Pricing 2: 1=0,20000, 10=0,13500, 50=0,13500, 100=0,05600, 1000=0,03900, 10000=0,02700 (USD); Supplier 3: Digi-Key; Supplier Part Number 3: 1727-1144-6-ND; Stock 3: 109157; Pricing 3: 1=0,19000, 10=0,15300, 25=0,12840, 100=0,08120, 500=0,05344, 1000=0,03634 (USD)
Q?#3 = 2N7002E-7-F: MOSFET N-Channel; Manufacturer: Diodes; Continuous Drain Current (ID): 250mA; Rds On Max: 3R; Input Capacitance: 50pF; Drain to Source Voltage (Vdss): 60V; Max Power Dissipation: 370mW; Turn-Off Delay Time: 11ns; Turn-On Delay Time: 7ns; Gate to Source Voltage (Vgs): 20V; Drain to Source Resistance: 4R; Power Dissipation: 540mW; Number of Elements: 1; Element Configuration: Single; Manufacturer Part Number: 2N7002E-7-F; RoHS: Yes; Category: MOSFETs; Stock 1: 1805; Pricing 1: 5=0,03360, 25=0,03050, 100=0,02730, 250=0,02520, 500=0,02210, 1000=0,01680 (GBP); Mount: Surface Mount; Case/Package: SOT-23-3; Number of Pins: 3; Weight: 0.000282oz; Min Operating Temperature: -55°C; Max Operating Temperature: 150°C; Packaging: Tape and Reel; Package Quantity: 1; Drain to Source Breakdown Voltage: 60V; Number of Channels: 1; On-State Resistance: 4R; Polarity: N-CHANNEL; Series: -; Drain-source On Resistance-Max: 4R; Length: 2.9mm; Width: 1.3mm; Height: 1mm; Radiation Hardening: No; Lead Free: Lead Free; REACH SVHC: No SVHC; RoHS Compliant: Yes; ComponentLink1URL: https://datasheet.ciiva.com/4443/ds30376-87503-4443073.pdf?src-supplier=Mouser; ComponentLink1Description: https://datasheet.ciiva.com/4443/ds30376-87503-4443073.pdf?src-supplier=Mouser; ComponentLink2URL: https://datasheet.ciiva.com/16305/ds30376-16305448.pdf?src-supplier=Future+Electronics; ComponentLink2Description: https://datasheet.ciiva.com/16305/ds30376-16305448.pdf?src-supplier=Future+Electronics; ComponentLink3URL: https://datasheet.ciiva.com/11174/ds30376-11174910.pdf?src-supplier=Avnet; ComponentLink3Description: https://datasheet.ciiva.com/11174/ds30376-11174910.pdf?src-supplier=Avnet; ComponentLink4URL: https://datasheet.ciiva.com/6371/ds30376-6371036.pdf?src-supplier=Digi-Key; ComponentLink4Description: https://datasheet.ciiva.com/6371/ds30376-6371036.pdf?src-supplier=Digi-Key; ComponentLink5URL: https://datasheet.ciiva.com/6371/ds30376-6371039.pdf?src-supplier=Digi-Key; ComponentLink5Description: https://datasheet.ciiva.com/6371/ds30376-6371039.pdf?src-supplier=Digi-Key; Stock 2: 8667; Pricing 2: 1=0,27000, 10=0,18100, 50=0,18100, 100=0,08700, 1000=0,05100, 10000=0,03400 (USD); Stock 3: 35005; Pricing 3: 1=0,29000, 10=0,19800, 25=0,18720, 100=0,09680, 500=0,08074, 1000=0,05610 (USD); Stock 4: 10690; Pricing 4: 10=0,06870, 100=0,05240, 300=0,04940, 1000=0,04640, 5000=0,04510, 10000=0,04450, 10=0,06680, 100=0,05100, 300=0,04810, 1000=0,04520, 5000=0,04390, 10000=0,04330, 10=0,34300, 100=0,26180, 300=0,24690, 1000=0,23190, 5000=0,22540, 10000=0,22220, 10=0,32960, 100=0,25160, 300=0,23720, 1000=0,22280, 5000=0,21660, 10000=0,21350, 10=0,04430, 100=0,03380, 300=0,03190, 1000=0,03000, 5000=0,02910, 10000=0,02870, 10=0,03820, 100=0,02910, 300=0,02750, 1000=0,02580, 5000=0,02510, 10000=0,02470, 10=0,40990, 100=0,31290, 300=0,29500, 1000=0,27720, 5000=0,26940, 10000=0,26550, 10=5,72380, 100=4,36870, 300=4,11940, 1000=3,87010, 5000=3,76170, 10000=3,70750, 10=0,21510, 100=0,16420, 300=0,15480, 1000=0,14540, 5000=0,14140, 10000=0,13930, 10=3,92540, 100=2,99610, 300=2,82510, 1000=2,65410, 5000=2,57980, 10000=2,54260, 10=0,45030, 100=0,34370, 300=0,32410, 1000=0,30440, 5000=0,29590, 10000=0,29160, 10=0,07090, 100=0,05410, 300=0,05100, 1000=0,04790, 5000=0,04660, 10000=0,04590, 10=0,05280, 100=0,04030, 300=0,03800, 1000=0,03570, 5000=0,03470, 10000=0,03420 (AUD); Supplier 1: Farnell; Supplier Part Number 1: 3577032; Supplier 2: Mouser; Supplier Part Number 2: 621-2N7002E-7-F; Supplier 3: Digi-Key; Supplier Part Number 3: 2N7002E-FDIDKR-ND; Supplier 4: LCSC; Supplier Part Number 4: C151383; Supplier 5: Mouser; Supplier Part Number 5: 771-NX7002AKAR; Supplier 6: Farnell; Supplier Part Number 6: 3287982
R?#1 = MCWW12W0R05FTL: Res, 0R05, 1%, 0.75W, 1206, Thick Film; Manufacturer: Multicomp; Supplier 1: Farnell; Manufacturer Part Number: MCWW12W0R05FTL; RoHS: No; Stock 1: 4386; Pricing 1: 10=0,18300, 100=0,09790, 500=0,07440, 1000=0,06530 (GBP); ComponentLink1URL: http://www.farnell.com/datasheets/2189763.pdf?src-supplier=Farnell; ComponentLink1Description: http://www.farnell.com/datasheets/2189763.pdf?src-supplier=Farnell; ComponentLink2URL: http://www.farnell.com/datasheets/2189763.pdf?src-supplier=Newark; ComponentLink2Description: http://www.farnell.com/datasheets/2189763.pdf?src-supplier=Newark; Supplier Part Number 1: 2695178
R?#2 R?#9 R?#11 R?#12 = CR0603-FX-1003ELF: Bourns CR0603-FX Series Thick Film Surface Mount Fixed Resistor 0603 Case 100k 1% 0.1W 100ppm/C; Temperature Coefficient: 100ppm/°C; Resistance: 100kR; Voltage Rating (DC): 50V; Max Power Dissipation: 100mW; Manufacturer: Bourns; Manufacturer Part Number: CR0603-FX-1003ELF; RoHS: Yes; Category: Chip SMD Resistors; Stock 1: 282; Pricing 1: 1=0,10000, 10=0,01700, 100=0,00680, 1000=0,00305, 2500=0,00264 (USD); Mount: Surface Mount; Case/Package: 0603; Number of Pins: 2; Contact Plating: Tin; Case Code (Metric): 1608; Case Code (Imperial): 0603; Min Operating Temperature: -55°C; Max Operating Temperature: 155°C; Resistor Type: Thick Film; Tolerance: 1%; Number of Terminations: 2; Termination: SMD/SMT; Features: Moisture Resistant; Packaging: Tape and Reel; Power Rating: 100mW; Voltage Rating: 50V; Package Quantity: 1; Working Voltage: 50V; Length: 1.6mm; Width: 0.031inch; Height: 0.022inch; Depth: 0.8mm; Thickness: 457um; Radiation Hardening: No; REACH SVHC: No SVHC; Military Standard: Not; ComponentLink1URL: https://datasheet.ciiva.com/11808/0900766b80fcdb72-11808036.pdf?src-supplier=RSComponents; ComponentLink1Description: https://datasheet.ciiva.com/11808/0900766b80fcdb72-11808036.pdf?src-supplier=RSComponents; ComponentLink2URL: https://datasheet.ciiva.com/19466/1163741-19466516.pdf?src-supplier=Jameco; ComponentLink2Description: https://datasheet.ciiva.com/19466/1163741-19466516.pdf?src-supplier=Jameco; ComponentLink3URL: https://datasheet.ciiva.com/41449/001055485-da-01-en-smd-wid-cr0603-fx-1003elf-100k-ohm-1-10w-41449971.pdf?src-supplier=Conrad; ComponentLink3Description: https://datasheet.ciiva.com/41449/001055485-da-01-en-smd-wid-cr0603-fx-1003elf-100k-ohm-1-10w-41449971.pdf?src-supplier=Conrad; ComponentLink4URL: https://datasheet.ciiva.com/46385/691949-46385260.pdf?src-supplier=Element14; ComponentLink4Description: https://datasheet.ciiva.com/46385/691949-46385260.pdf?src-supplier=Element14; ComponentLink5URL: https://datasheet.ciiva.com/6547/chpreztr-6547309.pdf?src-supplier=Digi-Key; ComponentLink5Description: https://datasheet.ciiva.com/6547/chpreztr-6547309.pdf?src-supplier=Digi-Key; ComponentLink6URL: https://datasheet.ciiva.com/6547/chpreztr-6547310.pdf?src-supplier=Digi-Key; ComponentLink6Description: https://datasheet.ciiva.com/6547/chpreztr-6547310.pdf?src-supplier=Digi-Key; ComponentLink7URL: https://datasheet.ciiva.com/3255/chpreztr-3255919.pdf?src-supplier=Avnet; ComponentLink7Description: https://datasheet.ciiva.com/3255/chpreztr-3255919.pdf?src-supplier=Avnet; ComponentLink8URL: https://datasheet.ciiva.com/16782/70154685-16782911.pdf?src-supplier=Allied+Electronics; ComponentLink8Description: https://datasheet.ciiva.com/16782/70154685-16782911.pdf?src-supplier=Allied+Electronics; ComponentLink9URL: https://datasheet.ciiva.com/22693/1902866-22693207.pdf?src-supplier=Element14; ComponentLink9Description: https://datasheet.ciiva.com/22693/1902866-22693207.pdf?src-supplier=Element14; ComponentLink10URL: https://datasheet.ciiva.com/16941/chpreztr-16941643.pdf?src-supplier=Avnet+Europe; ComponentLink10Description: https://datasheet.ciiva.com/16941/chpreztr-16941643.pdf?src-supplier=Avnet+Europe; ComponentLink11URL: https://datasheet.ciiva.com/15159/getdatasheetpartid-57636-15159629.pdf?src-supplier=Verical; ComponentLink11Description: https://datasheet.ciiva.com/15159/getdatasheetpartid-57636-15159629.pdf?src-supplier=Verical; ComponentLink12URL: https://datasheet.ciiva.com/5546/chpreztr-5546894.pdf?src-supplier=Mouser; ComponentLink12Description: https://datasheet.ciiva.com/5546/chpreztr-5546894.pdf?src-supplier=Mouser; ComponentLink13URL: https://datasheet.ciiva.com/7986/1902866-7986158.pdf?src-supplier=Element14; ComponentLink13Description: https://datasheet.ciiva.com/7986/1902866-7986158.pdf?src-supplier=Element14; ComponentLink14URL: https://datasheet.ciiva.com/6547/chpreztr-6547311.pdf?src-supplier=Digi-Key; ComponentLink14Description: https://datasheet.ciiva.com/6547/chpreztr-6547311.pdf?src-supplier=Digi-Key; ComponentLink15URL: https://datasheet.ciiva.com/30120/159chpreztr-30120559.pdf?src-supplier=Onlinecomponents.com; ComponentLink15Description: https://datasheet.ciiva.com/30120/159chpreztr-30120559.pdf?src-supplier=Onlinecomponents.com; Supplier 1: Digi-Key; Supplier 2: Mouser; Supplier 3: Farnell; Supplier Part Number 1: CR0603-FX-1003ELFCT-ND; Supplier Part Number 2: 652-CR0603-FX-103ELF; Supplier Part Number 3: 2008342
R?#3 R?#4 R?#7 = CR0603-FX-5101ELF: Res Thick Film 0603 5.1K Ohm 1% 1/10W ±100ppm/C Molded SMD SMD Paper Tape on Plastic Reel; Manufacturer: Bourns; Resistance: 5.1kR; Temperature Coefficient: 100ppm/°C; Power Rating: 100mW; Voltage Rating: 50V; Supplier 1: Digi-Key; Manufacturer Part Number: CR0603-FX-5101ELF; RoHS: Yes; Category: Chip SMD Resistors; Stock 1: 5051; Pricing 1: 1=0,10000, 10=0,01700, 100=0,00680, 1000=0,00305, 2500=0,00264 (USD); Mount: Surface Mount; Case/Package: 0603; Contact Plating: Tin; Case Code (Imperial): 0603; Case Code (Metric): 1608; Min Operating Temperature: -55°C; Max Operating Temperature: 155°C; Tolerance: 1%; Resistor Type: Thick Film; Packaging: Tape and Reel; Package Quantity: 5000; Termination: SMD/SMT; Features: Moisture Resistant; Series: CR0603; Max Power Dissipation: 100mW; Number of Terminations: 2; Construction: Rectangular; Voltage Rating (DC): 50V; Resistance Tolerance: 1%; Length: 1.6mm; Width: 0.8mm; Height: 0.45mm; Thickness: 457um; Depth: 0.8mm; Radiation Hardening: No; RoHS Compliant: Yes; Military Standard: Not; REACH SVHC: No SVHC; ComponentLink1URL: https://datasheet.ciiva.com/16939/chpreztr-16939916.pdf?src-supplier=Avnet+Europe; ComponentLink1Description: https://datasheet.ciiva.com/16939/chpreztr-16939916.pdf?src-supplier=Avnet+Europe; Supplier 2: Mouser; Supplier 3: Farnell; Supplier Part Number 1: CR0603-FX-5101ELFCT-ND; Supplier Part Number 2: 652-CR0603FX-5101ELF; Supplier Part Number 3: 2333596
R?#5 R?#6 R?#10 = CR0603-FX-1002ELF: Thick Film Resistors 10K 1% 1/10W; Manufacturer: Bourns; Resistance: 10kR; Temperature Coefficient: 100ppm/°C; Power Rating: 100mW; Voltage Rating: 50V; Manufacturer Part Number: CR0603-FX-1002ELF; RoHS: Yes; Category: Chip SMD Resistors; Stock 1: 5832; Pricing 1: 1=0,10000, 10=0,01700, 100=0,00680, 1000=0,00305, 2500=0,00264 (USD); Mount: Surface Mount; Case/Package: 0603; Number of Pins: 2; Contact Plating: Tin; Case Code (Metric): 1608; Case Code (Imperial): 0603; Min Operating Temperature: -55°C; Max Operating Temperature: 155°C; Tolerance: 1%; Resistor Type: Thick Film; Packaging: Tape and Reel; Package Quantity: 5000; Number of Terminations: 2; Termination: SMD/SMT; Max Power Dissipation: 100mW; Voltage Rating (DC): 50V; Features: Moisture Resistant; Series: CR0603; Resistance Tolerance: 1%; Technology: THICK FILM; Construction: Rectangular; Length: 1.6mm; Width: 0.8mm; Height: 0.45mm; Depth: 0.8mm; Thickness: 457um; Radiation Hardening: No; REACH SVHC: No SVHC; Military Standard: Not; RoHS Compliant: Yes; ComponentLink1URL: https://datasheet.ciiva.com/11808/0900766b80fcdb72-11808032.pdf?src-supplier=RSComponents; ComponentLink1Description: https://datasheet.ciiva.com/11808/0900766b80fcdb72-11808032.pdf?src-supplier=RSComponents; ComponentLink2URL: https://datasheet.ciiva.com/27049/774903-27049975.pdf?src-supplier=Jameco; ComponentLink2Description: https://datasheet.ciiva.com/27049/774903-27049975.pdf?src-supplier=Jameco; ComponentLink3URL: https://datasheet.ciiva.com/22693/1902866-22693206.pdf?src-supplier=Element14; ComponentLink3Description: https://datasheet.ciiva.com/22693/1902866-22693206.pdf?src-supplier=Element14; ComponentLink4URL: https://datasheet.ciiva.com/7001/1902866-7001623.pdf?src-supplier=Newark; ComponentLink4Description: https://datasheet.ciiva.com/7001/1902866-7001623.pdf?src-supplier=Newark; ComponentLink5URL: https://datasheet.ciiva.com/16757/70154685-16757483.pdf?src-supplier=Allied+Electronics; ComponentLink5Description: https://datasheet.ciiva.com/16757/70154685-16757483.pdf?src-supplier=Allied+Electronics; ComponentLink6URL: https://datasheet.ciiva.com/22644/1849498-22644171.pdf?src-supplier=Element14; ComponentLink6Description: https://datasheet.ciiva.com/22644/1849498-22644171.pdf?src-supplier=Element14; ComponentLink7URL: https://datasheet.ciiva.com/16938/chpreztr-16938733.pdf?src-supplier=Avnet+Europe; ComponentLink7Description: https://datasheet.ciiva.com/16938/chpreztr-16938733.pdf?src-supplier=Avnet+Europe; ComponentLink8URL: https://datasheet.ciiva.com/3255/chpreztr-3255918.pdf?src-supplier=Avnet; ComponentLink8Description: https://datasheet.ciiva.com/3255/chpreztr-3255918.pdf?src-supplier=Avnet; ComponentLink9URL: https://datasheet.ciiva.com/5548/chpreztr-5548911.pdf?src-supplier=Mouser; ComponentLink9Description: https://datasheet.ciiva.com/5548/chpreztr-5548911.pdf?src-supplier=Mouser; Supplier 1: Digi-Key; Supplier 2: Digi-Key; Supplier 3: Mouser; Supplier Part Number 1: CR0603-FX-1002ELFCT-ND; Supplier Part Number 2: CR0603-FX-1002ELFDKR-ND; Supplier Part Number 3: 652-CR0603FX-1002ELF